# Altium project arduino uno.PrjPcb (part 1 of 3)
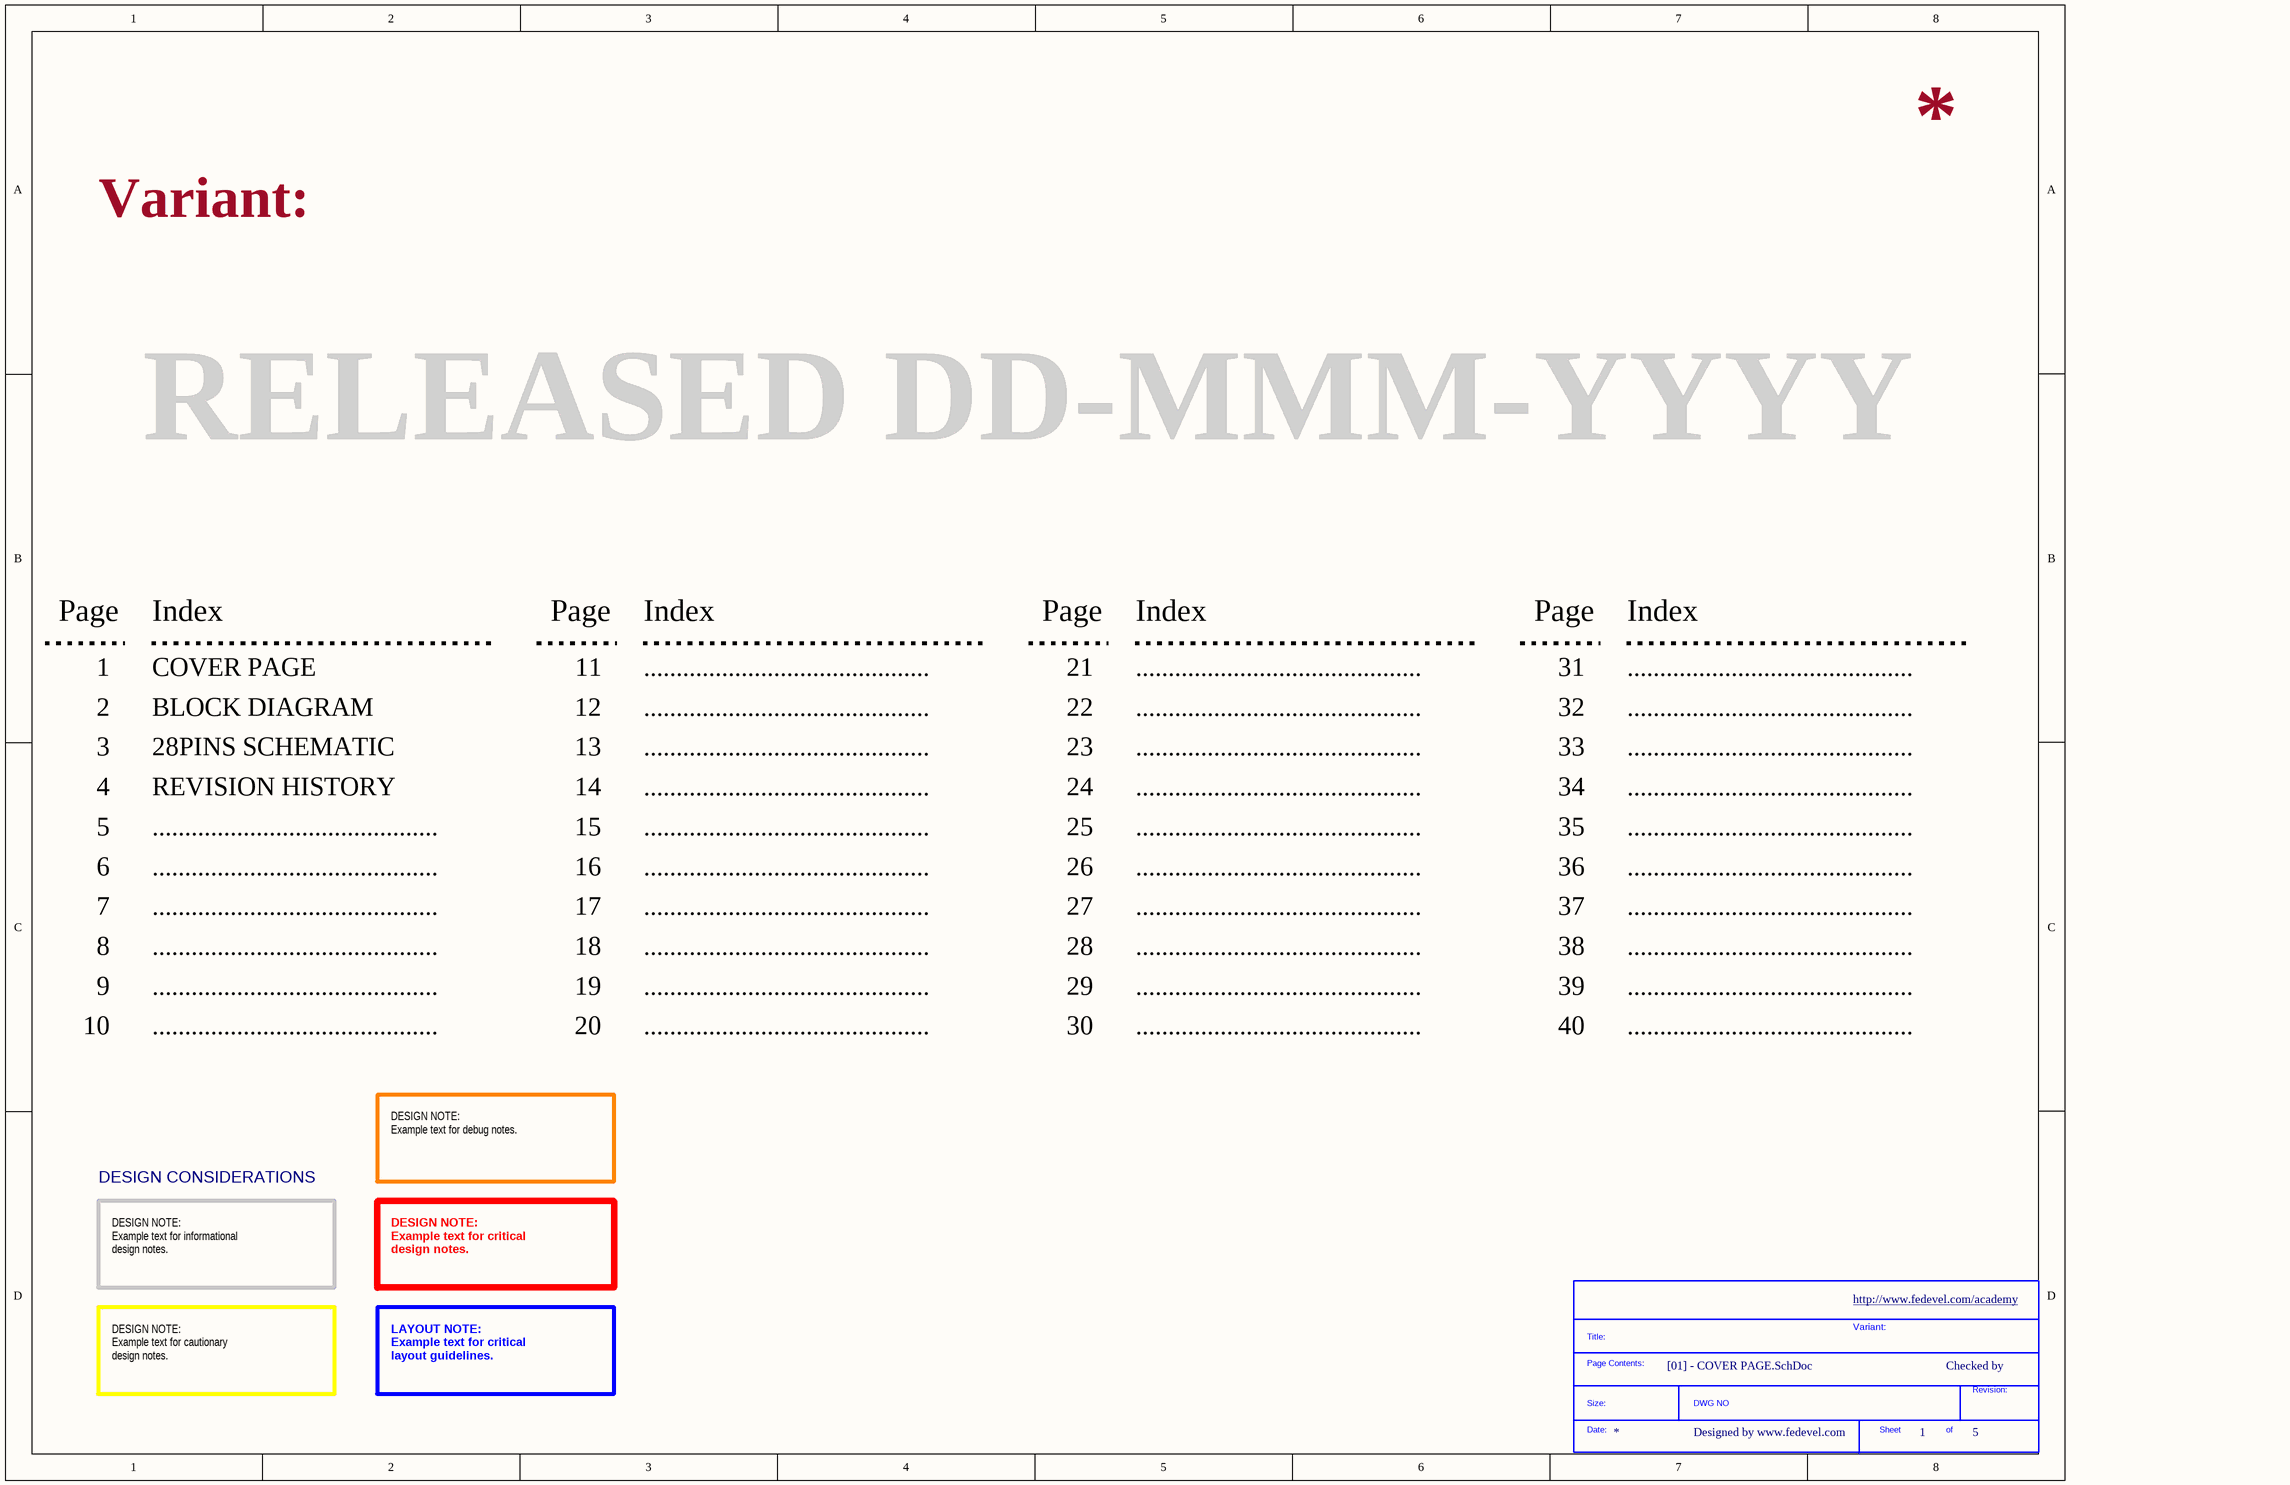
[diagram p0: [01] - COVER PAGE.SchDoc]
NotFitted: NF; Title: 28pins
4 sheets, 112 parts. Net scope: global (net labels, ports and power ports of the same name join across sheets).
Board file: arduinoUnoPCB.PcbDoc
Sheets:
  [01] - COVER PAGE.SchDoc
  arduinoUnoSchema.SchDoc
  [02] - BLOCK DIAGRAM.SchDoc
  [04] - REVISION HISTORY.SchDoc

## Sheet [01] - COVER PAGE.SchDoc: 28pins
size A3; DocumentNumber: 1; SheetNumber: 1; SheetTotal: 5

### Parts
(Parts that share a designator on the sheet are numbered #1, #2 ... from top to bottom, then left to right.)
*#1  SDTitleBlock  (value not drawn)  (graphical)

### Notes on the sheet
- Variant:
- RELEASED DD-MMM-YYYY
- Page
- Index
- 1
- COVER PAGE
- 11
- ............................................
- 21
- 31
- 2
- 3
- BLOCK DIAGRAM
- 28PINS SCHEMATIC
- 12
- 13
- 22
- 23
- 32
- 33
- 4
- 5
- REVISION HISTORY
- 14
- 15
- 24
- 25
- 34
- 35
- 6
- 16
- 26
- 36
- 7
- 8
- 17
- 18
- 27
- 28
- 37
- 38
- 9
- 10
- 19
- 20
- 29
- 30
- 39
- 40
- DESIGN NOTE:
  Example text for debug notes.
- DESIGN CONSIDERATIONS
- DESIGN NOTE:
  Example text for informational
  design notes.
- DESIGN NOTE:
  Example text for critical
  design notes.
- http://www.fedevel.com/academy
- Checked by
- DESIGN NOTE:
  Example text for cautionary
  design notes.
- LAYOUT NOTE:
  Example text for critical
  layout guidelines.
- Designed by www.fedevel.com
- (in symbol SDTitleBlock) Title:; Page Contents:; Revision:; Size:; DWG NO; Date:; Sheet; of

## Sheet arduinoUnoSchema.SchDoc: 28pins
size A2
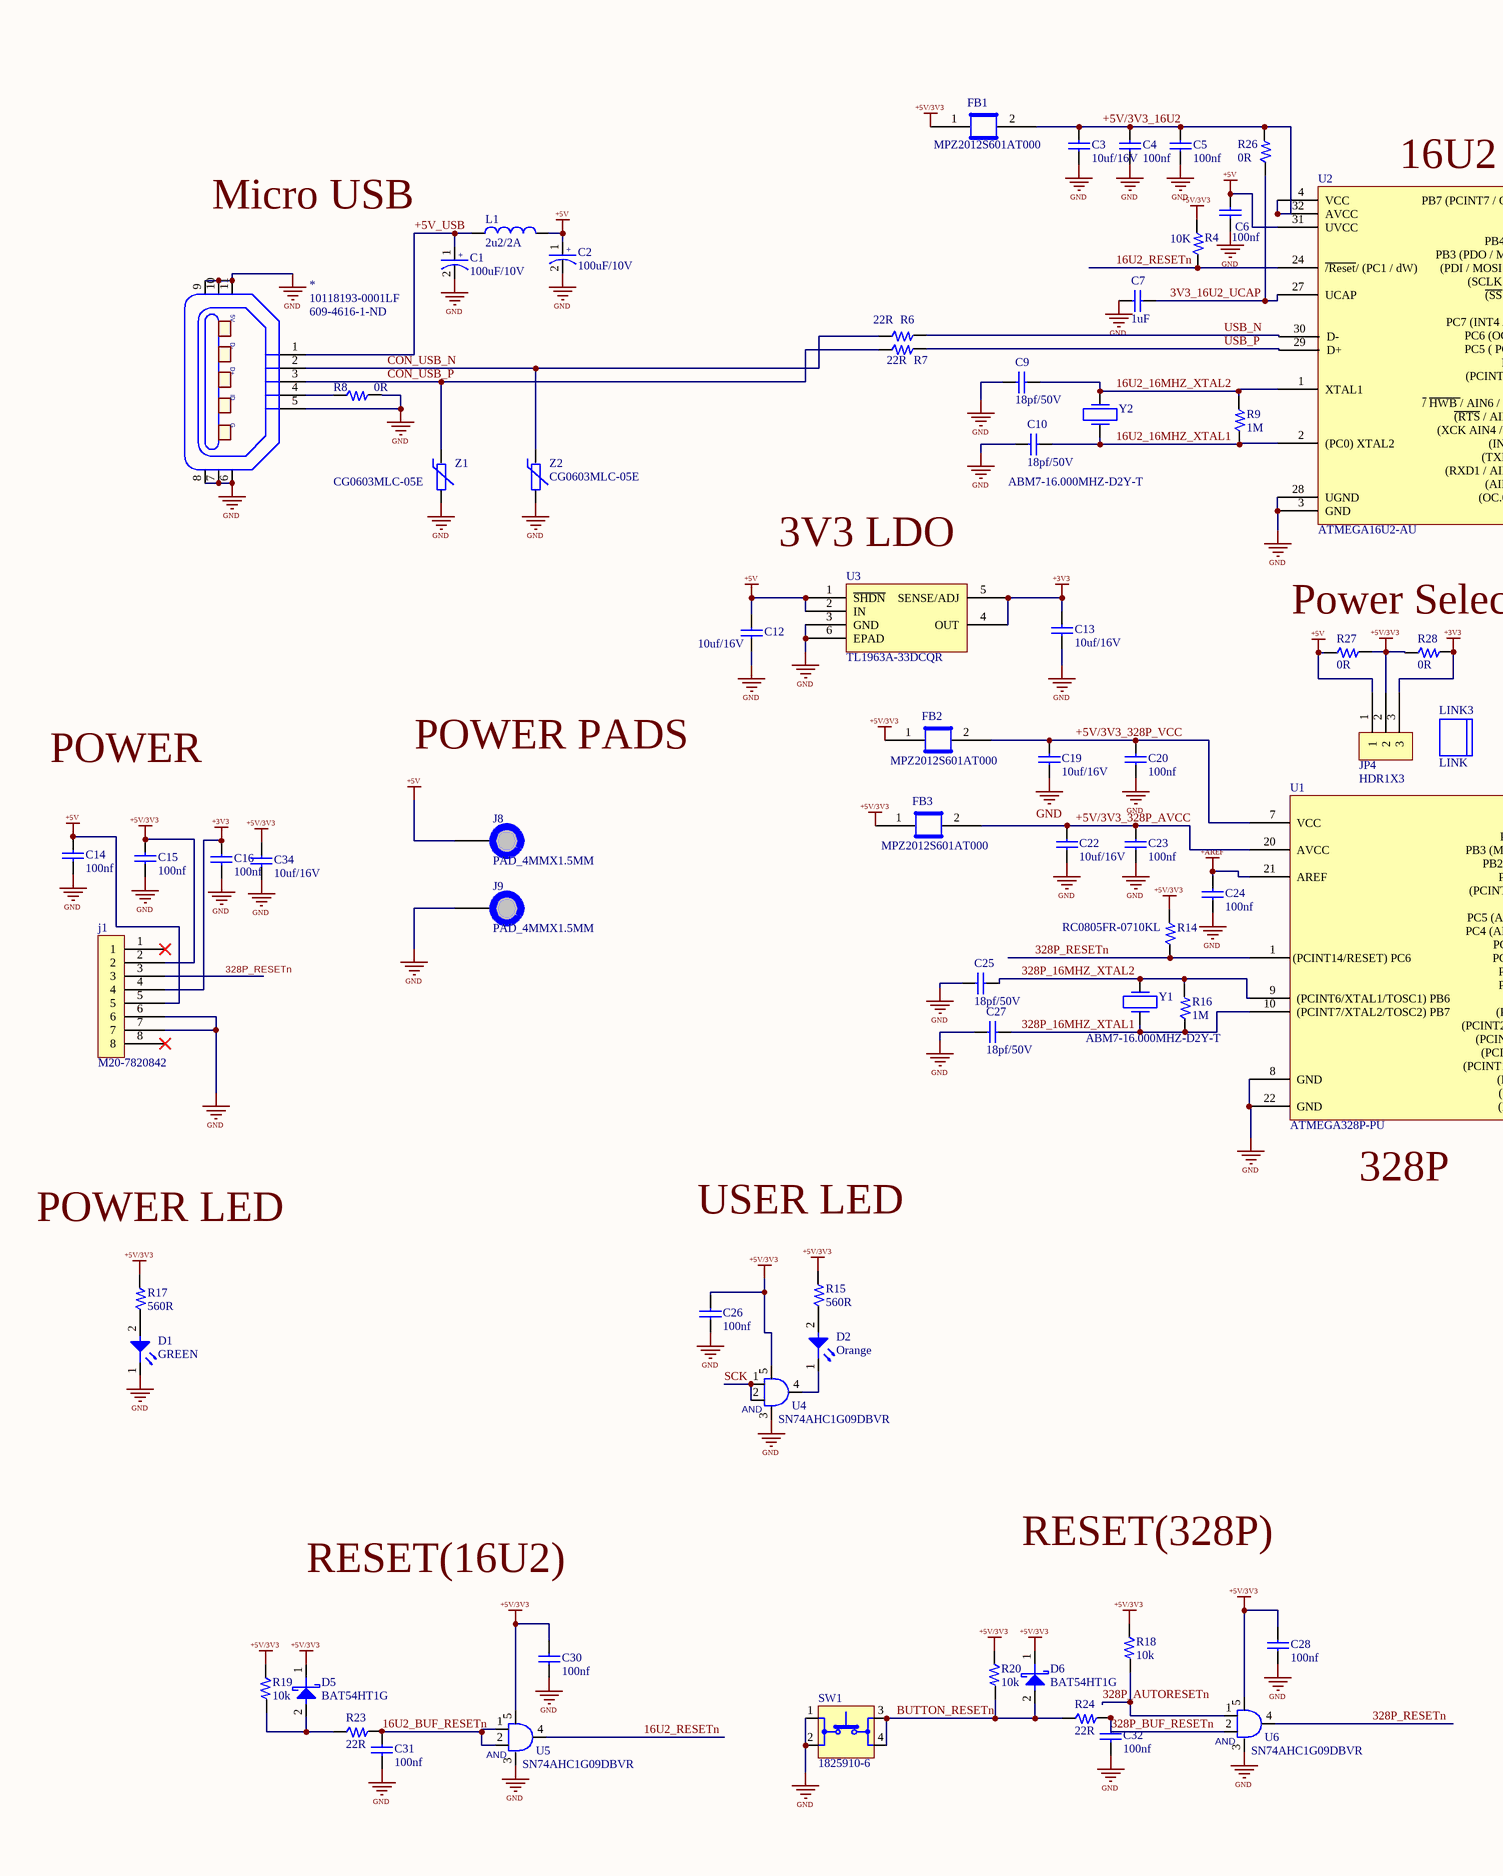
[diagram p1: arduinoUnoSchema.SchDoc, left]
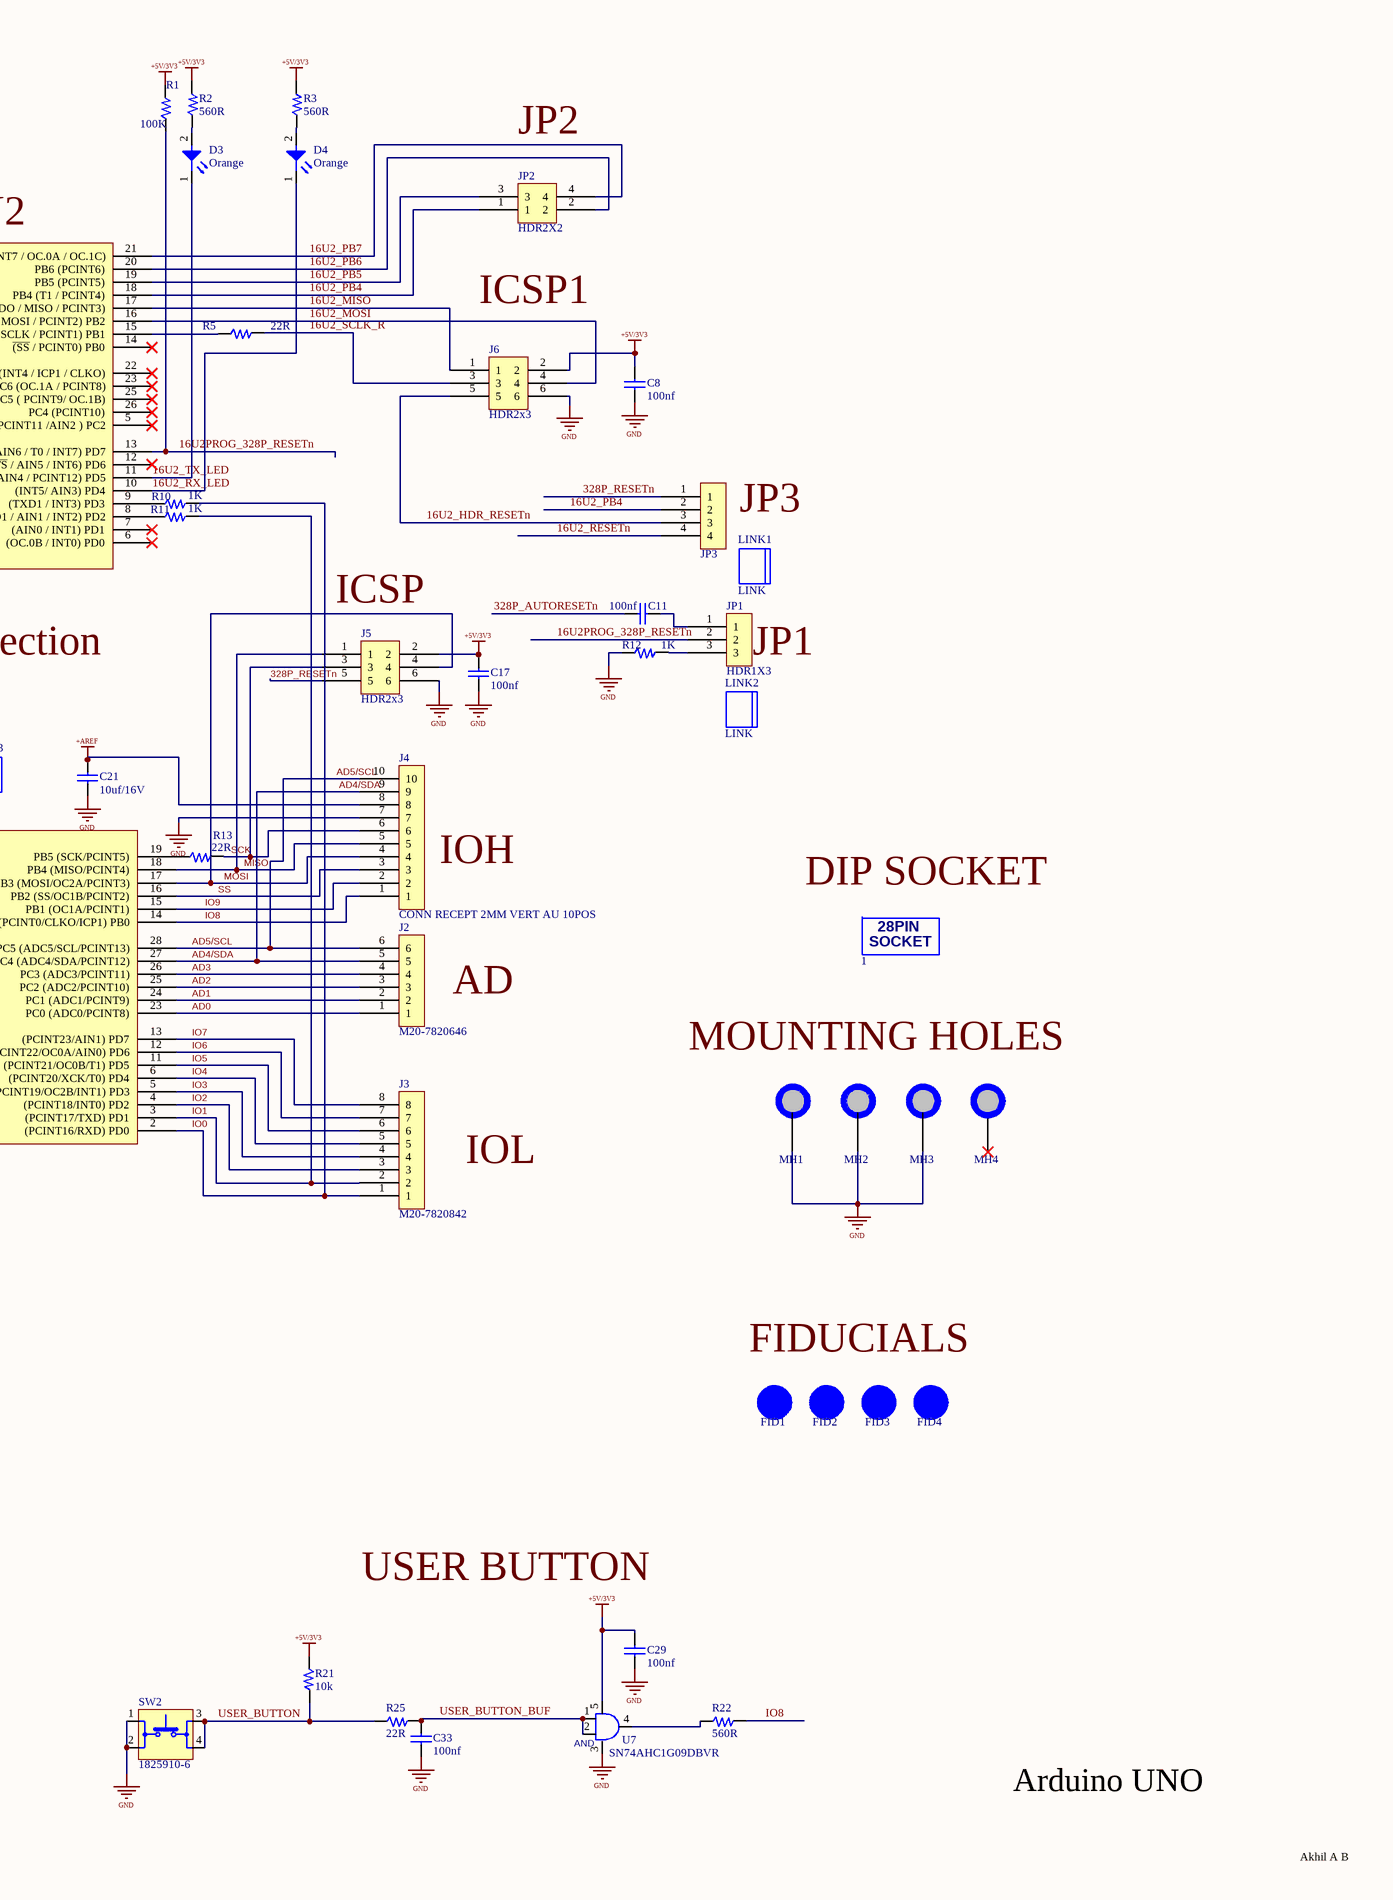
[diagram p2: arduinoUnoSchema.SchDoc, right]

### Parts
(Parts that share a designator on the sheet are numbered #1, #2 ... from top to bottom, then left to right.)
1  4828-3004-CP  [28_PIN_DIP_SOCKET]  (value not drawn)
*#2  10118193-0001LF  Supplier Part Number 1: 609-4616-1-ND  [MICROUSB]
C1  100uF/10V  [C_ALUMINIUM_C_SIZE]
C2  100uF/10V  [C_ALUMINIUM_C_SIZE]
C3  10uf/16V  [C0805]
C4  100nf  [C0805]
C5  100nf  [C0805]
C6  100nf  [C0805]
C7  1uF  [C0805]
C8  100nf  [C0805]
C9  18pf/50V  [C0805]
C10  18pf/50V  [C0805]
C11  100nf  [C0805]
C12  10uf/16V  [C0805]
C13  10uf/16V  [C0805]
C14  100nf  [C0805]
C15  100nf  [C0805]
C16  100nf  [C0805]
C17  100nf  [C0805]
C19  10uf/16V  [C0805]
C20  100nf  [C0805]
C21  10uf/16V  [C0805]
C22  10uf/16V  [C0805]
C23  100nf  [C0805]
C24  100nf  [C0805]
C25  18pf/50V  [C0805]
C26  100nf  [C0805]
C27  18pf/50V  [C0805]
C28  100nf  [C0805]
C29  100nf  [C0805]
C30  100nf  [C0805]
C31  100nf  [C0805]
C32  100nf  [C0805]
C33  100nf  [C0805]
C34  10uf/16V  [C0805]
D1  GREEN  [LED_FP]
D2  Orange  [LED_FP]
D3  Orange  [LED_FP]
D4  Orange  [LED_FP]
D5  BAT54HT1G  [SOD323]
D6  BAT54HT1G  [SOD323]
FB1  MPZ2012S601AT000  [C0805]
FB2  MPZ2012S601AT000  [C0805]
FB3  MPZ2012S601AT000  [C0805]
FID1  FID  [FID4MMX1.2]  (value not drawn)  (no BOM)
FID2  FID  [FID4MMX1.2]  (value not drawn)  (no BOM)
FID3  FID  [FID4MMX1.2]  (value not drawn)  (no BOM)
FID4  FID  [FID4MMX1.2]  (value not drawn)  (no BOM)
j1  M20-7820842  [M20-7820842]
J2  M20-7820646  [M20-7820646]
J3  M20-7820842  [M20-7820842]
J4  CONN RECEPT 2MM VERT AU 10POS  [M22-7131042 - duplicate]
J5  HDR2x3  [HDR2x3]
J6  HDR2x3  [HDR2x3]
J8  PAD_4MMX1.5MM  [PAD_4MMX1.5MM]  (no BOM)
J9  PAD_4MMX1.5MM  [PAD_4MMX1.5MM]  (no BOM)
JP1  HDR1X3  [HDR1X3]
JP2  HDR2X2  [HDR2X2]
JP3  68001-204HLF  [HDR1X4]  (value not drawn)
JP4  HDR1X3  [HDR1X3]
L1  2u2/2A  [C1210IND]
LINK1  LINK
LINK2  LINK
LINK3  LINK
MH1  MOUNTING HOLE  [MOUNTING_HOLE_7MMX3.2MM]  (value not drawn)  (no BOM)
MH2  MOUNTING HOLE  [MOUNTING_HOLE_7MMX3.2MM]  (value not drawn)  (no BOM)
MH3  MOUNTING HOLE  [MOUNTING_HOLE_7MMX3.2MM]  (value not drawn)  (no BOM)
MH4  MOUNTING_HOLE_7MMX3.2MM_NON_PLATED  [MOUNTING_HOLE_NONPLATED_7.2X3.2]  (value not drawn)
R1  100K  [R0805]
R2  560R  [R0805]
R3  560R  [R0805]
R4  10K  [R0805]
R5  22R  [R0805]
R6  22R  [R0805]
R7  22R  [R0805]
R8  0R  [R0805]
R9  1M  [R0805]
R10  1K  [R0805]
R11  1K  [R0805]
R12  1K  [R0805]
R13  22R  [R0805]
R14  RC0805FR-0710KL  [R0805]
R15  560R  [R0805]
R16  1M  [R0805]
R17  560R  [R0805]
R18  10k  [R0805]
R19  10k  [R0805]
R20  10k  [R0805]
R21  10k  [R0805]
R22  560R  [R0805]
R23  22R  [R0805]
R24  22R  [R0805]
R25  22R  [R0805]
R26  0R  [R0805]
R27  0R  [R0805]
R28  0R  [R0805]
SW1  1825910-6  [SWC4]
SW2  1825910-6  [SWC4]
U1  ATMEGA328P-PU  [DIP28]
U2  ATMEGA16U2-AU  [TQPF32]
U3  TL1963A-33DCQR  [DCQ]
U4  SN74AHC1G09DBVR  [DBVSOP23-5]
U5  SN74AHC1G09DBVR  [DBVSOP23-5]
U6  SN74AHC1G09DBVR  [DBVSOP23-5]
U7  SN74AHC1G09DBVR  [DBVSOP23-5]
Y1  ABM7-16.000MHZ-D2Y-T  [Abm7Crybig]
Y2  ABM7-16.000MHZ-D2Y-T  [Abm7Crybig]
Z1  CG0603MLC-05E  [R0603]
Z2  CG0603MLC-05E  [R0603]

### Nets
+3V3: C13.2 C16.2 j1.4 JP4.3 R28.2 U3.4(OUT) U3.5(SENSE/ADJ)
+5V: C2.1 C6.2 C12.2 C14.2 j1.5 J8.1 JP4.1 L1.2 R27.1 U2.31(UVCC) U3.1(~{SHDN}) U3.2(IN)
+5V/3V3: C8.2 C15.2 C17.2 C26.2 C28.2 C29.2 C30.2 C34.2 D5.1(cathode) D6.1(cathode) FB1.1 FB2.1 FB3.1 j1.2 J5.2 J6.2 JP4.2 R1.2 R2.2 R3.2 R4.2 R14.2 R15.2 R17.2 R18.1 R19.1 R20.1 R21.1 R27.2 R28.1 U4.5 U5.5 U6.5 U7.5
+AREF: C21.2 C24.2 J4.8 U1.21(AREF)
GND: *#2.5 *#2.6 *#2.7 *#2.8 *#2.9 *#2.10 *#2.11 C1.2 C2.2 C3.1 C4.1 C5.1 C6.1 C7.1 C8.1 C9.1 C10.1 C12.1 C13.1 C14.1 C15.1 C16.1 C17.1 C19.1 C20.1 C21.1 C22.1 C23.1 C24.1 C25.1 C26.1 C27.1 C28.1 C29.1 C30.1 C31.1 C32.1 C33.1 C34.1 D1.1(cathode) j1.6 j1.7 J4.7 J5.6 J6.6 J9.1 MH1.1 MH2.1 MH3.1 R8.2 R12.1 SW1.1 SW1.2 SW2.1 SW2.2 U1.8(GND) U1.22(GND) U2.3(GND) U2.28(UGND) U3.3(GND) U3.6(EPAD) U4.3 U5.3 U6.3 U7.3 Z1.1 Z2.1
3V3_16U2_UCAP: C7.2 R26.1 U2.27(UCAP)
16U2_16MHZ_XTAL1: C10.2 R9.1 U2.2((PC0)_XTAL2) Y2.1
16U2_16MHZ_XTAL2: C9.2 R9.2 U2.1(XTAL1) Y2.2
16U2_BUF_RESETn: C31.2 R23.2 U5.1 U5.2
16U2_HDR_RESETn: J6.5 JP3.3
16U2_MISO: J6.1 U2.17(PB3_(PDO_/_MISO_/_PCINT3))
16U2_MOSI: J6.4 U2.16((PDI_/_MOSI_/_PCINT2)_PB2)
16U2_PB4: JP2.1 JP3.2 U2.18(PB4_(T1_/_PCINT4))
16U2_PB5: JP2.3 U2.19(PB5_(PCINT5))
16U2_PB6: JP2.2 U2.20(PB6_(PCINT6))
16U2_PB7: JP2.4 U2.21(PB7_(PCINT7_/_OC.0A_/_OC.1C))
16U2_RESETn: JP3.4 R4.1 U2.24(~{/Reset}/_(PC1_/_dW)) U5.4
16U2_RX_LED: D4.1(cathode) U2.10((INT5/_AIN3)_PD4)
16U2_SCLK_R: J6.3 R5.2
16U2_TX_LED: D3.1(cathode) U2.11((XCK_AIN4_/_PCINT12)_PD5)
16U2PROG_328P_RESETn: JP1.2 R1.1 U2.13(~{/}_~{HWB_}/_AIN6_/_T0_/_INT7)_PD7)
328P_16MHZ_XTAL1: C27.2 R16.1 U1.10((PCINT7/XTAL2/TOSC2)_PB7) Y1.1
328P_16MHZ_XTAL2: C25.2 R16.2 U1.9((PCINT6/XTAL1/TOSC1)_PB6) Y1.2
328P_AUTORESETn: C11.1 R18.2 U6.1
328P_BUF_RESETn: C32.2 R24.2 U6.2
328P_RESETn: j1.3 J5.5 JP3.1 R14.1 U1.1((PCINT14/RESET)_PC6) U6.4
+5V/3V3_16U2: C3.2 C4.2 C5.2 FB1.2 R26.2 U2.4(VCC) U2.32(AVCC)
+5V/3V3_328P_AVCC: C22.2 C23.2 FB3.2 U1.20(AVCC)
+5V/3V3_328P_VCC: C19.2 C20.2 FB2.2 U1.7(VCC)
+5V_USB: *#2.1 C1.1 L1.1
AD0: J2.1 U1.23(PC0_(ADC0/PCINT8))
AD1: J2.2 U1.24(PC1_(ADC1/PCINT9))
AD2: J2.3 U1.25(PC2_(ADC2/PCINT10))
AD3: J2.4 U1.26(PC3_(ADC3/PCINT11))
AD4/SDA: J2.5 J4.9 U1.27(PC4_(ADC4/SDA/PCINT12))
AD5/SCL: J2.6 J4.10 U1.28(PC5_(ADC5/SCL/PCINT13))
BUTTON_RESETn: D6.2(Anode) R20.2 R24.1 SW1.3 SW1.4
CON_USB_N: *#2.2 R6.1 Z2.2
CON_USB_P: *#2.3 R7.1 Z1.2
IO0: J3.1 R10.2 U1.2((PCINT16/RXD)_PD0)
IO1: J3.2 R11.2 U1.3((PCINT17/TXD)_PD1)
IO2: J3.3 U1.4((PCINT18/INT0)_PD2)
IO3: J3.4 U1.5((PCINT19/OC2B/INT1)_PD3)
IO4: J3.5 U1.6((PCINT20/XCK/T0)_PD4)
IO5: J3.6 U1.11((PCINT21/OC0B/T1)_PD5)
IO6: J3.7 U1.12((PCINT22/OC0A/AIN0)_PD6)
IO7: J3.8 U1.13((PCINT23/AIN1)_PD7)
IO8: J4.1 R22.2 U1.14((PCINT0/CLKO/ICP1)_PB0)
IO9: J4.2 U1.15(PB1_(OC1A/PCINT1))
MISO: J4.5 J5.1 U1.18(PB4_(MISO/PCINT4))
MOSI: J4.4 J5.4 U1.17(PB3_(MOSI/OC2A/PCINT3))
SCK: J4.6 J5.3 R13.2 U4.1 U4.2
SS: J4.3 U1.16(PB2_(SS/OC1B/PCINT2))
USB_N: R6.2 U2.30(D-)
USB_P: R7.2 U2.29(D+)
USER_BUTTON: R21.2 R25.1 SW2.3 SW2.4
USER_BUTTON_BUF: C33.2 R25.2 U7.1 U7.2
Net*#2_4: *#2.4 R8.1
NetC11_2: C11.2 JP1.1
NetD1_2: D1.2(Anode) R17.1
NetD2_1: D2.1(cathode) U4.4
NetD2_2: D2.2(Anode) R15.1
NetD3_2: D3.2(Anode) R2.1
NetD4_2: D4.2(Anode) R3.1
NetD5_2: D5.2(Anode) R19.2 R23.1
NetJP1_3: JP1.3 R12.2
NetR5_1: R5.1 U2.15((SCLK_/_PCINT1)_PB1)
NetR10_1: R10.1 U2.9((TXD1_/_INT3)_PD3)
NetR11_1: R11.1 U2.8((RXD1_/_AIN1_/_INT2)_PD2)
NetR13_1: R13.1 U1.19(PB5_(SCK/PCINT5))
NetR22_1: R22.1 U7.4

Not connected (* = marked no-connect by the designer): j1 1* 8*; MH4 1*; U2 5((PCINT11_/AIN2_)_PC2)* 6((OC.0B_/_INT0)_PD0)* 7((AIN0_/_INT1)_PD1)* 12(~{(RTS}_/_AIN5_/_INT6)_PD6)* 14(~{(SS}_/_PCINT0)_PB0)* 22(PC7_(INT4_/_ICP1_/_CLKO))* 23(PC6_(OC.1A_/_PCINT8))* 25(PC5_(_PCINT9/_OC.1B))* 26(PC4_(PCINT10))*

### Notes on the sheet
- JP2
- (near U2) 16U2
- Micro USB
- ICSP1
- JP3
- (near U3) 3V3 LDO
- (near J5) ICSP
- Power Selection
- (near JP1) JP1
- POWER
- POWER PADS
- (near J4) IOH
- (near 1) DIP SOCKET
- AD
- MOUNTING HOLES
- (near U1) 328P
- IOL
- POWER LED
- USER LED
- FIDUCIALS
- RESET(16U2)
- RESET(328P)
- USER BUTTON
- Arduino UNO
- Akhil A B
- (in symbol 100uF) +
- (in symbol 4828-3004-CP) 28PIN; SOCKET
- (in symbol 10118193-0001LF) 5V; D-; D+; ID; G